# EAGLE design TAH Relay and Sensor Shield (EAGLE 7.0.0)
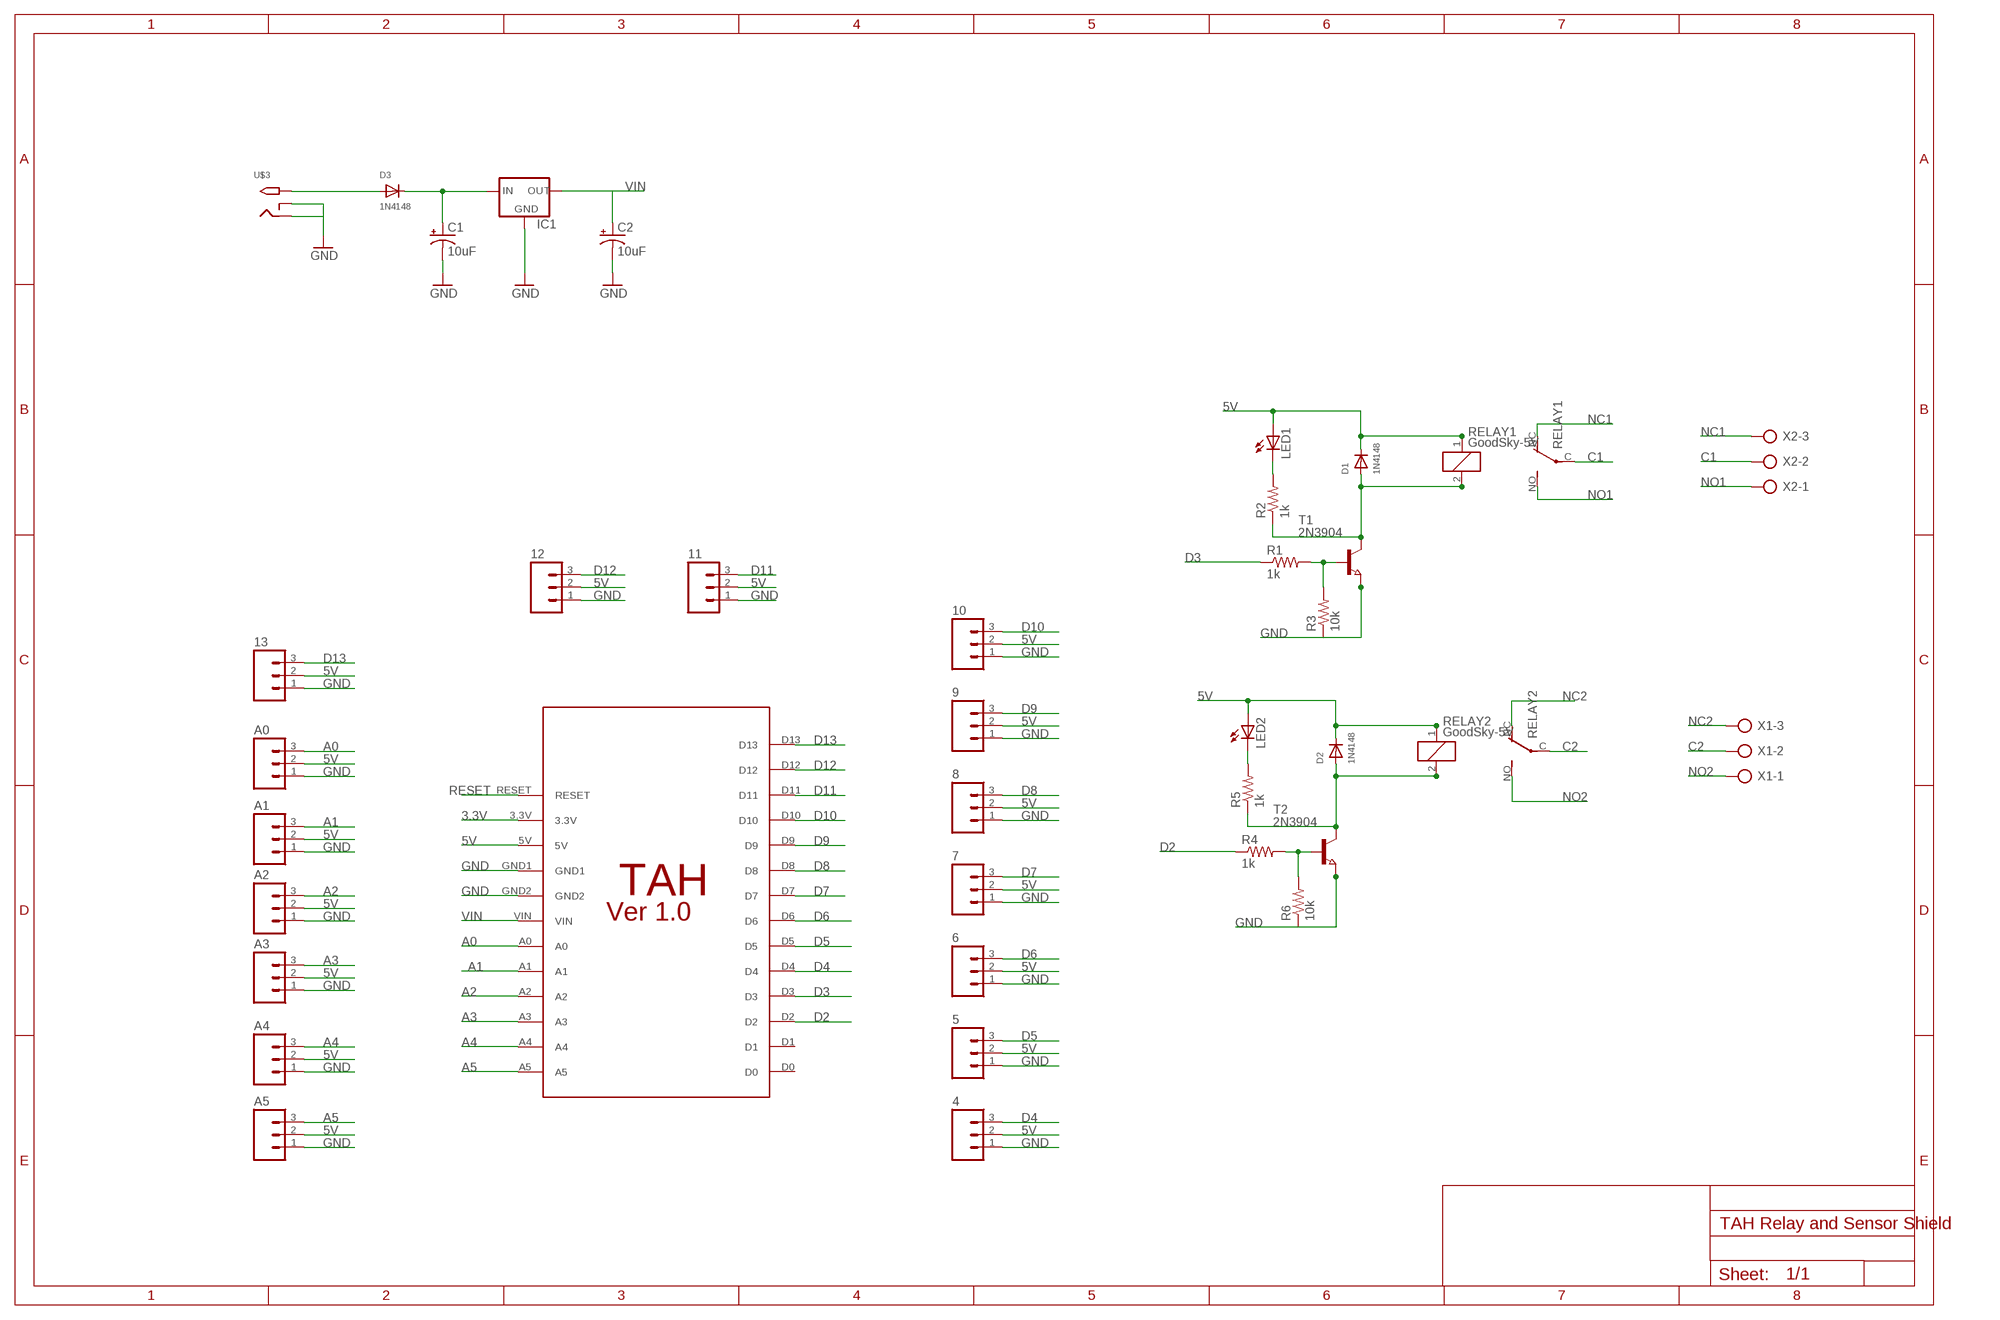
[diagram p0: schematic, sheet 1]

## Parts
4  M03POLAR  [MOLEX-1X3]
5  M03POLAR  [MOLEX-1X3]
6  M03POLAR  [MOLEX-1X3]
7  M03POLAR  [MOLEX-1X3]
8  M03POLAR  [MOLEX-1X3]
9  M03POLAR  [MOLEX-1X3]
10  M03POLAR  [MOLEX-1X3]
11  M03POLAR  [MOLEX-1X3]
12  M03POLAR  [MOLEX-1X3]
13  M03POLAR  [MOLEX-1X3]
A0  M03POLAR  [MOLEX-1X3]
A1  M03POLAR  [MOLEX-1X3]
A2  M03POLAR  [MOLEX-1X3]
A3  M03POLAR  [MOLEX-1X3]
A4  M03POLAR  [MOLEX-1X3]
A5  M03POLAR  [MOLEX-1X3]
C1  10uF  CPOL-USE2,5-6E  [E2,5-6E]
C2  10uF  CPOL-USE2,5-6E  [E2,5-6E]
D1  1N4148  DIODESMA  [SMADIODE]
D2  1N4148  DIODESMA  [SMADIODE]
D3  1N4148  DIODESMA  [SMADIODE]
IC1  V_REG_78XX-TO-220  [TO-220-ALT]
LED1  LEDSMT1206  [1206]
LED2  LEDSMT1206  [1206]
R1  1k  R-US_R1206  [R1206]
R2  1k  R-US_R1206  [R1206]
R3  10k  R-US_R1206  [R1206]
R4  1k  R-US_R1206  [R1206]
R5  1k  R-US_R1206  [R1206]
R6  10k  R-US_R1206  [R1206]
RELAY1  GoodSky-5V  CQ1-12V  [CQ1]
RELAY2  GoodSky-5V  CQ1-12V  [CQ1]
T1  2N3904  NPN-TRANSISTOR_SOT23  [SOT23]
T2  2N3904  NPN-TRANSISTOR_SOT23  [SOT23]
U$1  TAH_PIN_FOOTPRINT_WITHOUT_ICSP_VER1.0  [FOOTPRINT_WITHOUT_ICSP]
U$3  2.1MMJACKTHM  [PJ-102A]
X1  AK300/3  [AK300/3]
X2  AK300/3  [AK300/3]

## Nets
3.3V: U$1.3.3V
5V: 4.2 5.2 6.2 7.2 8.2 9.2 10.2 11.2 12.2 13.2 A0.2 A1.2 A2.2 A3.2 A4.2 A5.2 D1.C D2.C LED1.A LED2.A RELAY1.1 RELAY2.1 U$1.5V
A0: A0.3 U$1.A0
A1: A1.3 U$1.A1
A2: A2.3 U$1.A2
A3: A3.3 U$1.A3
A4: A4.3 U$1.A4
A5: A5.3 U$1.A5
C1: RELAY1.C(2:P) X2.2
C2: RELAY2.C(2:P) X1.2
D2: R4.1 U$1.D2
D3: R1.1 U$1.D3
D4: 4.3 U$1.D4
D5: 5.3 U$1.D5
D6: 6.3 U$1.D6
D7: 7.3 U$1.D7
D8: 8.3 U$1.D8
D9: 9.3 U$1.D9
D10: 10.3 U$1.D10
D11: 11.3 U$1.D11
D12: 12.3 U$1.D12
D13: 13.3 U$1.D13
GND: 4.1 5.1 6.1 7.1 8.1 9.1 10.1 11.1 12.1 13.1 A0.1 A1.1 A2.1 A3.1 A4.1 A5.1 C1.- C2.- IC1.GND R3.1 R6.1 T1.2(E) T2.2(E) U$1.GND1 U$1.GND2 U$3.RING U$3.RING_SW
N$1: D2.A R5.1 RELAY2.2 T2.3(C)
N$2: R4.2 R6.2 T2.1(B)
N$3: LED2.C R5.2
N$4: D3.A U$3.TIP
N$5: C1.+ D3.C IC1.IN
N$14: D1.A R2.1 RELAY1.2 T1.3(C)
N$15: R1.2 R3.2 T1.1(B)
N$16: LED1.C R2.2
NC1: RELAY1.NC(2:O) X2.3
NC2: RELAY2.NC(2:O) X1.3
NO1: RELAY1.NO(2:S) X2.1
NO2: RELAY2.NO(2:S) X1.1
RESET: U$1.RESET
VIN: C2.+ IC1.OUT U$1.VIN
Unconnected: U$1.D0 U$1.D1

## Library data of the parts
4-13 A0 A1-A5 = SparkFun-Connectors:M03: Header 3 Standard 3-pin 0.1" header. Use with straight break away headers (SKU : PRT-00116), right angle break away headers (PRT-00553), swiss pins (PRT-00743), machine pins (PRT-00117), and female headers (PRT-00115). Molex polarized connector foot print use with SKU : PRT-08232 with associated crimp pins and housings.
C1 C2 = Arduino Shield Pin Out:CPOL-US: POLARIZED CAPACITOR, American symbol
D1-D3 = 1n4148 diode sot 23:DIODE: Diode SMADIODE - SMA Surface Mount Package 20V 1A Schottky Diode Digikey: 641-1014-6-ND DO-1N4148 - Through Hole Small Current Diode SOD-123 20V 1 A (.5mV Vf) Schottky Diode - Digikey: MBRX120TPMSCT-ND SOD-323 10V 570mA (.38mV Vf, 3ns) Schottky Diode - Digikey: ZLLS410CT-ND SOD-523 30V 30mA Schottky Diode (RB751S-40TE61) - Digikey: RB751S-40TE61CT-ND SOT23-R/W - SOT23 Package (R = Solder Paste/Reflow Ovens, W = Hand-Soldering) BAT54Film 40V 300mA - Digikey: 497-7162-1-ND
IC1 = SparkFun-PowerIC:V_REG_78XX: Voltage Regulator Standard 7805 5V regulator. IGO (Input Ground Output). Spark Fun Electronics SKU : COM-00107
LED1 LED2 = adafruit:LED: LED OSRAM: - CHIPLED LG R971, LG N971, LY N971, LG Q971, LY Q971, LO R971, LY R971 LH N974, LH R974 LS Q976, LO Q976, LY Q976 LO Q996 - Hyper CHIPLED LW Q18S LB Q993, LB Q99A, LB R99A - SideLED LS A670, LO A670, LY A670, LG A670, LP A670 LB A673, LV A673, LT A673, LW A673 LH A674 LY A675 LS A676, LA A676, LO A676, LY A676, LW A676 LS A679, LY A679, LG A679 - Hyper Micro SIDELED® LS Y876, LA Y876, LO Y876, LY Y876 LT Y87S - SmartLED LW L88C, LW L88S LB L89C, LB L89S, LG L890 LS L89K, LO L89K, LY L89K LS L896, LA L896, LO L896, LY L896 - TOPLED LS T670, LO T670, LY T670, LG T670, LP T670 LSG T670, LSP T670, LSY T670, LOP T670, LYG T670 LG T671, LOG T671, LSG T671 LB T673, LV T673, LT T673, LW T673 LH T674 LS T676, LA T676, LO T676, LY T676, LB T676, LH T676, LSB T676, LW T676 LB T67C, LV T67C, LT T67C, LS T67K, LO T67K, LY T67K, LW E67C LS E67B, LA E67B, LO E67B, LY E67B, LB E67C, LV E67C, LT E67C LW T67C LS T679, LY T679, LG T679 LS T770, LO T770, LY T770, LG T770, LP T770 LB T773, LV T773, LT T773, LW T773 LH T774 LS E675, LA E675, LY E675, LS T675 LS T776, LA T776, LO T776, LY T776, LB T776 LHGB T686 LT T68C, LB T68C - Hyper Mini TOPLED® LB M676 - Mini TOPLED Santana® LG M470 LS M47K, LO M47K, LY M47K Source: http://www.osram.convergy.de/
R1-R6 = resistor:R-US_: RESISTOR, American symbol
RELAY1 RELAY2 = GoodSky Relay:CQ1-12V: AUTOMOTIVE QUIET RELAY NAiS Source: http://www.mew-europe.com/.. en_ds_61208_0000.pdf; OC_FARNELL: unknown; OC_NEWARK: unknown
T1 T2 = semicon-smd-ipc:NPN-TRANSISTOR_: NPN TRANSISTOR
U$1 = TAH:TAH_PIN_FOOTPRINT_WITHOUT_ICSP_VER1.0
U$3 = 1n4148 diode sot 23:2.1MMJACK: 2.1mm x 5.5mm THM DC jack with internal switch. Digikey part #PJ-102A, 4UCON part #05537 2.1mm x 5.5mm SMT DC jack with internal switch. Digikey part #PJ-002A-SMT, 4UCON part #03267 By microbuilder.eu & adafruit.com
X1 X2 = phoenix connector:AK300/3: CONNECTOR; OC_FARNELL: unknown; OC_NEWARK: unknown

## Net classes
0 default: clearance 0.355 mm

## Board
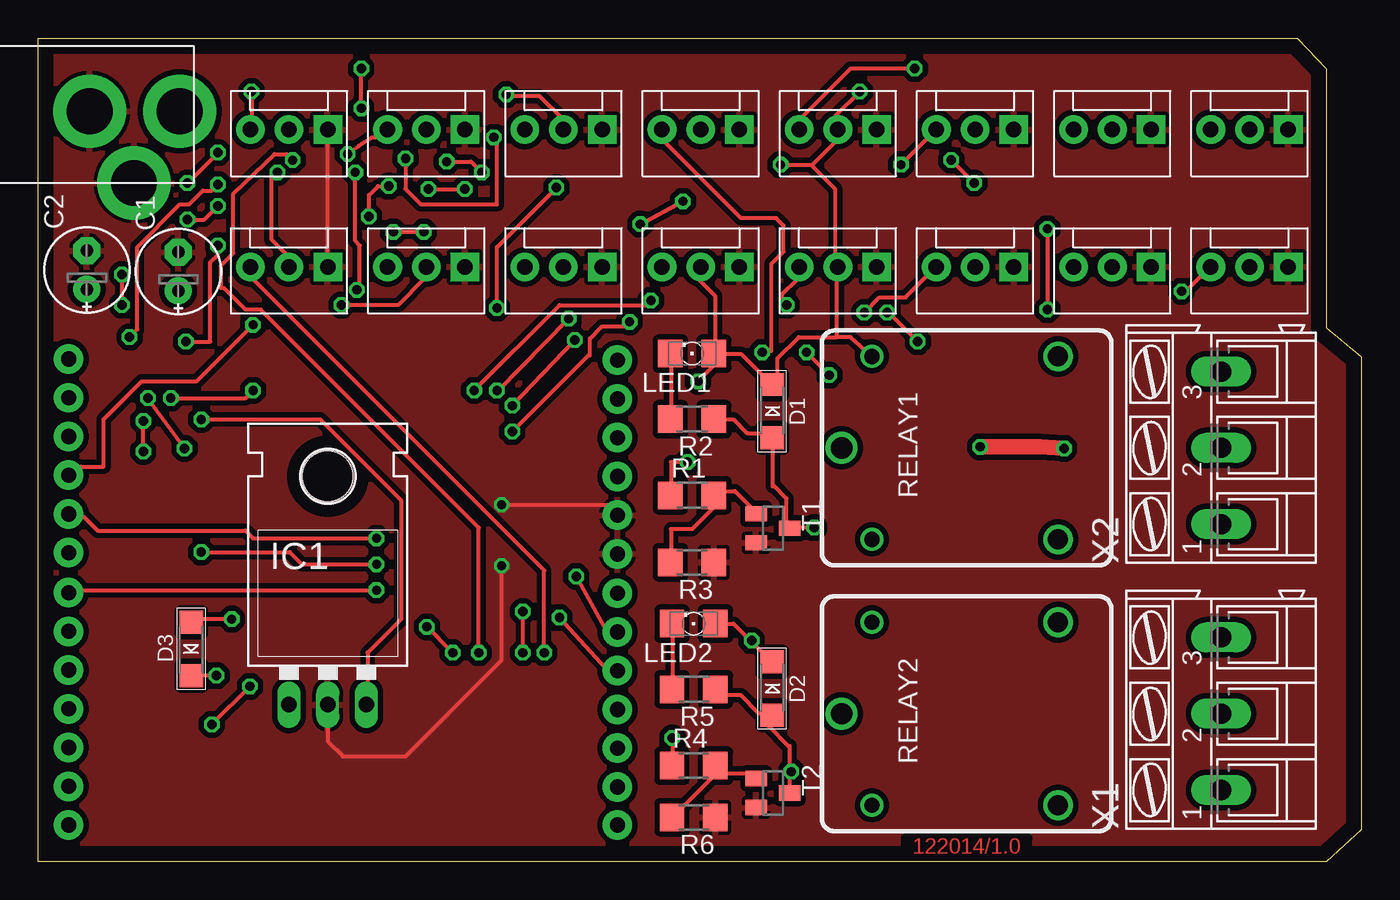
[diagram p1: board, top side]
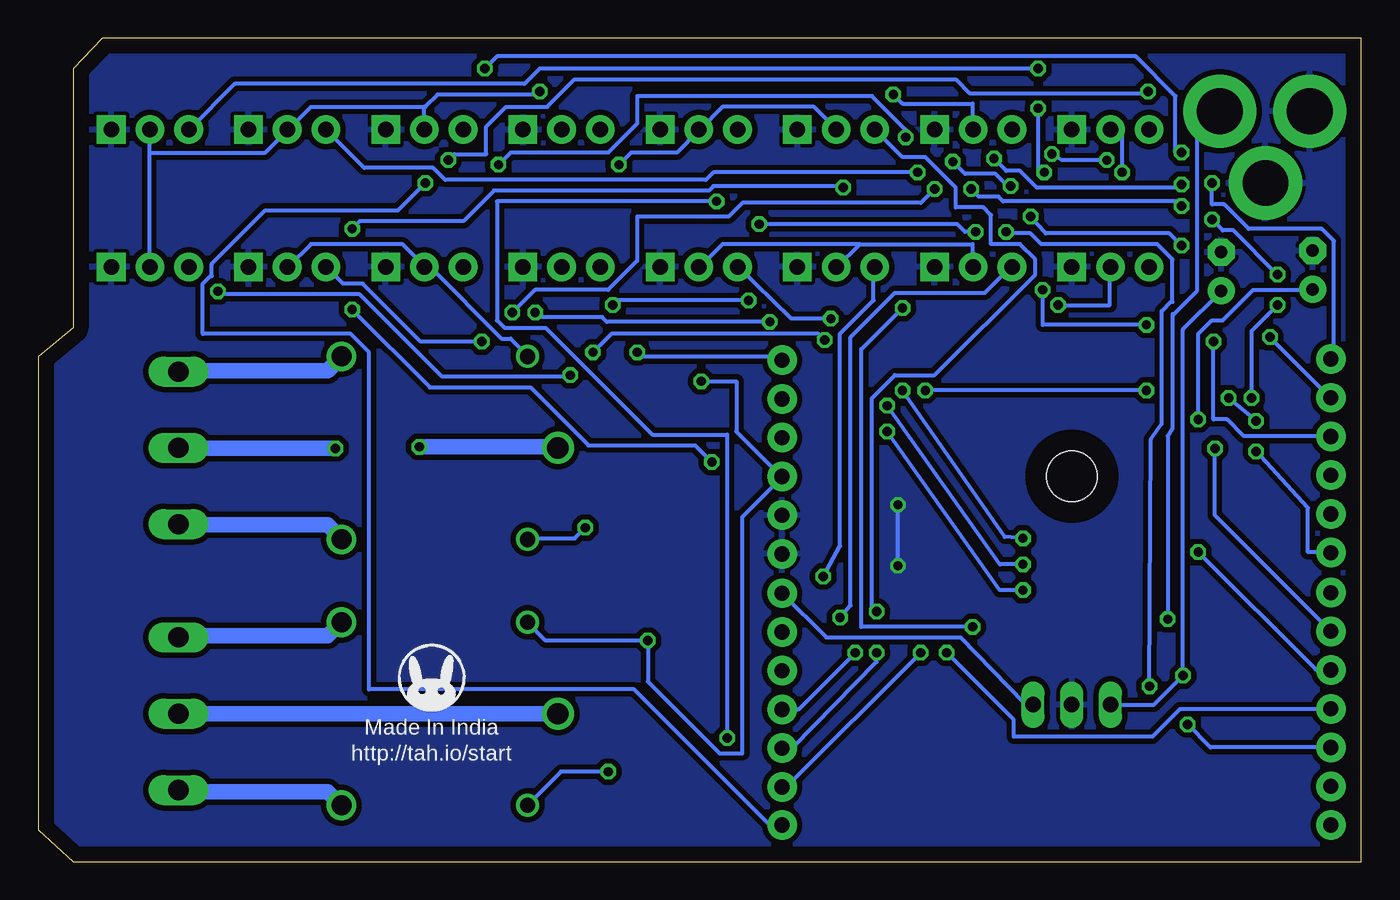
[diagram p2: board, bottom side, seen from below]

Size 86.8 x 54 mm. Coordinates in mm from the lower left corner, seen from the top.
Outline: 0,0 0,54 82.6,54 84.5,52 84.5,35 86.8,33.1 86.8,2.1 84.5,0 0,0
Copper layers (1*16): Top 0.035mm / dielectric 1.5mm / Bottom 0.035mm
Design rules "default": minimum track width 10mil, minimum drill 24mil, track to track 8mil, track to pad 8mil, pad to pad 8mil, via to via 8mil, smd to smd 8mil, copper to edge 40mil, drill to drill 8mil, minimum pad ring 10mil, minimum via ring 8mil, stop-mask expansion 4mil, vias tented up to drill 0mil, thermal gap 10mil

### Footprints (pad centres in the part's own frame; a part is rotated, then mirrored left to right if it is on the bottom)
MOLEX-1X3 = drill 1.016 pad 1.88 square: 1 0,0 | drill 1.016 pad 1.88: 2 2.54,0; 3 5.08,0
E2,5-6E = drill 0.813 pad 1.778: + -1.27,0 | drill 0.813 pad 1.778 octagon: - 1.27,0
SMADIODE = smd 1.524 x 1.5: A -0.05,-1.6; C -0.05,1.9
TO-220-ALT = drill 1.016 long: GND 0,-3.81; IN -2.54,-3.81; OUT 2.54,-3.81 | hole 3.302: 0,11.176
1206 = smd 1.6 x 1.803: A -1.422,0; C 1.422,0
R1206 = smd 1.6 x 1.803: 1 -1.422,0; 2 1.422,0
CQ1 = drill 1: 1 -6.3,6; 2 -6.3,-6 | drill 1.4: C -8.296,0 | drill 1.3: NC 5.9,6; NO 5.9,-6
SOT23 = smd 1 x 1.4: 1 -0.95,-1.1; 2 0.95,-1.1; 3 0,1.1
FOOTPRINT_WITHOUT_ICSP = drill 1 pad 1.93: 3.3V -17.55,11.97; 5V -17.55,9.43; A0 -17.55,-0.77; A1 -17.55,-3.31; A2 -17.55,-5.85; A3 -17.55,-8.39; A4 -17.55,-10.93; A5 -17.55,-13.43; D0 18.45,-13.43; D1 18.45,-10.89; D2 18.45,-8.35; D3 18.45,-5.81; D4 18.45,-3.27; D5 18.45,-0.73; D6 18.45,1.81; D7 18.45,4.43; D8 18.45,6.97; D9 18.45,9.51; D10 18.45,12.05; D11 18.45,14.59; D12 18.45,17.13; D13 -17.55,17.05; GND1 -17.55,6.89; GND2 -17.55,4.35; RESET -17.55,14.51; VIN -17.55,1.77
PJ-102A = drill 3 pad 4.8: RING 0.1,-3.39; RING_SW -4.6,-6.29; TIP 0.1,-9.29
AK300/3 = drill 1.321 long: 1 -5.004,0; 2 0,0; 3 5.004,0

### Placement (x,y rotation side)
4  82,39 180 top
5  73,39 180 top
6  64,39 180 top
7  55,39 180 top
8  46,39 180 top
9  82,48 180 top
10  73,48 180 top
11  64,48 180 top
12  55,48 180 top
13  46,48 180 top
A0  37,39 180 top
A1  28,39 180 top
A2  19,39 180 top
A3  37,48 180 top
A4  28,48 180 top
A5  19,48 180 top
C1  9.2,38.7 90 top
C2  3.2,38.8 90 top
D1  48.2,29.39 0 top
D2  48.2,11.2 0 top
D3  10,14.1 180 top
IC1  19,14.1 0 top
LED1  42.9,33.32 180 top
LED2  43,15.6 180 top
R1  42.9,24.02 0 top
R2  42.9,29.02 180 top
R3  42.9,19.62 180 top
R4  43,6.3 0 top
R5  43,11.3 180 top
R6  43,2.9 180 top
RELAY1  61,27.13 0 top
RELAY2  61,9.7 0 top
T1  48.2,21.86 270 top
T2  48.2,4.5 270 top
U$1  20.45,15.83 0 bottom
U$2  [TAHLOGO]  61,12.1 0 bottom
U$3  0,49.1 90 top
U$4  [TAH_SILK_FLIPPED]  20.6,17.7 0 top
X1  77.6,9.7 90 top
X2  77.6,27.13 90 top

### Tracks (layer width: path | path; a pad name or v marks a point on that pad's centre or on a via)
5V  (via drill 0.61)
  Top 0.254: v30.7,50.3 30.8,50.2 32.9,50.2 34.4,48.7 34.4,48 A3.2 | 50.8,45.7 52.3,47.2 52.4,47.2 52.4,48 12.2 52.4,48.1 52.3,48.1 52.3,48.9 v53.9,50.5 | v48.7,45.7 50.8,45.7 | 46.75,14.45 45.6,15.6 LED2.A | 46.75,14.45 48.1,13.1 D2.C | v46.8,14.5 46.75,14.45 | 52.4,34.4 52.4,39 7.2 52.4,39.1 52.3,39.1 52.3,44.1 50.8,45.6 50.8,45.7 | 52.4,34.4 53.3,34.4 54.6,33.2 54.7,33.2 RELAY1.1 | LED1.A 44.4,33.3 46.1,33.3 48.1,31.3 D1.C 48.2,31.4 48.5,31.4 48.5,33 49.9,34.4 52.4,34.4 | LED1.A 44.4,33.4 44.4,37.1 43.4,38.1 43.4,39 8.2 | v15.7,45.2 15.3,45.2 15.3,40.8 16.3,39.8 16.4,39.8 16.4,39 A2.2 | v19.9,36.5 23.6,36.5 25.4,38.3 25.4,39 A1.2 | v43.3,31.5 45,33.2 LED1.A
  Bottom 0.254: 61.5,49.5 61.5,48 11.2 | 61.5,49.5 68.9,49.5 70.4,48 10.2 70.5,47.9 71.9,46.5 79.5,46.5 | 79.5,46.5 79.5,48 9.2 | 79.5,46.5 79.5,39 4.2 | v30.7,50.3 30.1,49.7 25.5,49.7 25.5,48 A4.2 | A3.2 34.4,48 35.9,49.5 41.9,49.5 43.4,48 13.2 43.5,47.9 44.9,46.5 47.9,46.5 v48.7,45.7 | v53.9,50.5 54.1,50.3 60.6,50.3 61.4,49.5 61.5,49.5 | RELAY2.1 53.5,14.5 v46.8,14.5 46.8,11.8 42.1,7.1 40.6,7.1 40.6,22.6 38,25.2 U$1.5V 38.1,25.3 41,28.2 41,31.5 v43.3,31.5 | RELAY1.1 54.7,33.2 55.8,34.3 56.4,34.3 61.1,39 6.2 61.5,39.1 62.9,40.5 68.9,40.5 70.4,39 5.2 | v15.7,45.2 15.7,48 A5.2 | 32.9,40.5 25.5,40.5 25.5,39 A1.2 | 32.9,40.5 34.4,39 A0.2 | v19.9,36.5 16.5,36.5 16.5,39 A2.2 | 32.9,40.5 41.9,40.5 43.4,39 8.2
A0  (via drill 0.61)
  Top 0.254: v35.3,18.7 37.3,15.1 38,15.1 U$1.A0
  Bottom 0.254: v35.3,18.7 34.2,20.7 34.2,34.6 32,36.8 32,39 A0.3
A1  (via drill 0.61)
  Top 0.254: v34.2,16 37.3,12.6 38,12.6 U$1.A1
  Bottom 0.254: v34.2,16 33.5,16.8 33.5,34.4 30.6,37.3 24.7,37.3 23,39 A1.3
A2  (via drill 0.61)
  Top 0.254: v33.2,13.7 33.2,19.1 14.1,38.2 14,38.2 14,39 A2.3
  Bottom 0.254: v33.2,13.7 36.9,10 38,10 U$1.A2
A3  (via drill 0.61)
  Top 0.254: v31.8,13.7 v31.8,16.4
  Bottom 0.254: v31.8,16.4 32.1,16.4 32.1,30.4 30.6,31.9 28,31.9 21.4,38.5 21.4,39.5 22.4,40.5 24.3,40.5 24.3,42.4 24.8,42.9 26.6,42.9 26.6,44.2 28.6,46.2 30.1,46.2 31.9,48 A3.3 | v31.8,13.7 31.8,13.1 37.3,7.5 38,7.5 U$1.A3
A4  (via drill 0.6, 0.61)
  Top 0.254: v20.3,46.4 21,46.9 21.9,47.5 22.3,47.5 22.9,48 A4.3 | v16.7,46 16.3,46.4 15.5,46.4 12.8,43.8 12.8,39.9 12,39.1 12,37.6 12.2,37.6 13.6,36.2 14.6,36.2 28.9,21.9 v28.9,13.7
  Bottom 0.254: v16.7,46 19.6,46 v20.3,46.4 | v28.9,13.7 37.7,4.9 U$1.A4
A5  (via drill 0.61)
  Top 0.254: v14,50.5 14,48 A5.3 | v61.4,44.5 v59.9,46
  Bottom 0.254: v14,50.5 14.1,50.4 25.7,50.4 26.6,51.3 51.6,51.3 53.4,49.5 56.1,49.5 57.4,48.2 57.4,46.4 59.5,46.4 v59.9,46 | v61.4,44.5 63.2,42.7 71.9,42.7 75.4,39.2 75.4,38.4 75.5,38.4 76,37.9 76,34.6 66.3,34.6 65.1,33.4 65.1,11.3 47.7,11.3 38.8,2.4 U$1.A5
C1  (via drill 0.61)
  Top 1.016: v67.3,27.1 65.7,27.2 v61.8,27.2
  Bottom 0.254: 77.6,27.1 X2.2 | 52.8,27.2 RELAY1.C
  Bottom 1.016: v67.3,27.1 77.6,27.1 | 52.8,27.2 v61.8,27.2
C2
  Bottom 1.016: RELAY2.C X1.2
D2  (via drill 0.61)
  Top 0.254: v41.6,8.1 41.6,6.3 R4.1 | v39.5,41.8 v42.3,43.3 | v23.3,41.3 v25.3,41.3 | v11.4,9 v13.9,11.5
  Bottom 0.254: v41.6,8.1 41.6,28 46.5,28 53.5,35 56.2,35 56.7,35.5 56.7,43.3 v42.3,43.3 | v25.3,41.3 26,41.3 26.5,41.8 v39.5,41.8 | v23.3,41.3 23.1,41.2 21.7,41.2 21,40.5 13.4,40.5 12.4,39.5 12.4,36.7 12.5,36.7 13.1,36.1 13.1,28.7 13.8,27.7 v13.9,11.5 | v11.4,9 9.9,7.5 2,7.5 U$1.D2
D3  (via drill 0.61)
  Top 0.254: v42.6,26.2 41.5,26.2 41.5,24.1 R1.1 | v66.2,41.5 v66.2,36.2 | v34,44.2 30.1,40.3 v30.1,36.3 | v27.2,13.7 v25.5,15.4
  Bottom 0.254: v42.6,26.2 43.7,27.3 50.7,27.3 54.5,31.1 61.1,31.1 v66.2,36.2 | v66.2,41.5 65.7,42 58.9,42 56.9,44 42.8,44 42.5,44.3 34.1,44.3 v34,44.2 | v30.1,36.3 32.8,33.6 32.8,15.4 v25.5,15.4 | v27.2,13.7 22.8,9.3 22.8,8.2 13.7,8.2 11.9,10 2,10 U$1.D3
D4  (via drill 0.61)
  Top 0.254: v75,37.4 75.3,37.4 76.9,39 4.3 | v50.4,33.4 v51.9,31.9 | v31.1,29.9 v35.2,34.2 | v22.2,19.5 21.3,19.5 17.3,19.5 16.5,20.3 v10.7,20.3
  Bottom 0.254: v75,37.4 74.8,37.2 65.7,37.2 60.3,31.8 52,31.8 v51.9,31.9 | v50.4,33.4 49.2,34.6 35.6,34.6 v35.2,34.2 | v31.1,29.9 23.7,19.5 v22.2,19.5 | v10.7,20.3 3,12.6 2,12.6 U$1.D4
D5  (via drill 0.61)
  Top 0.254: v57.7,34.1 55.8,36 v55.7,36 | v25.6,44.1 v28,44.1 | v11.8,43 10.9,42.1 v9.8,42.1 | v5.5,36.5 v5.5,38.5 | v9.6,27.1 v7.2,30.4
  Bottom 0.254: v57.7,34.1 61.7,34.1 65.5,37.9 66.8,37.9 67.9,39 5.3 | v55.7,36 54.2,37.5 49.4,37.5 47.5,39.4 47.5,42.3 41.5,42.3 40.6,43.2 28.9,43.2 v28,44.1 | v25.6,44.1 25.1,43.6 23.8,43.6 23.5,43.3 12.1,43.3 v11.8,43 | v9.8,42.1 9.1,41.4 8.4,41.4 v5.5,38.5 | v5.5,36.5 7.2,34.8 v7.2,30.4 | v9.6,27.1 9.6,22.7 U$1.D5
D6  (via drill 0.61)
  Top 0.254: v54.2,36 55.2,37 56.9,37 58.9,39 6.3 | v38.8,35.4 38.5,35.1 37,35.1 36.2,34.3 36.2,33.2 36.1,33.2 v31.1,28.2 | v22.2,17.8 2.1,17.8 2,17.7 U$1.D6
  Bottom 0.254: v54.2,36 53.9,35.7 49.8,35.7 49.5,35.4 v38.8,35.4 | v31.1,28.2 23.7,17.8 v22.2,17.8
D7  (via drill 0.61)
  Top 0.254: v49.1,36.5 48.8,36.5 48.8,37.2 49.8,38.2 49.9,38.2 49.9,39 7.3 | v40.2,36.8 39.9,36.5 34.2,36.5 v28.6,30.9 | v14.1,30.9 13.6,30.4 v8.7,30.4 | v6.9,26.9 v6.9,28.9
  Bottom 0.254: v49.1,36.5 48.8,36.8 v40.2,36.8 | v14.1,30.9 v28.6,30.9 | v6.9,28.9 v8.7,30.4 | v6.9,26.9 3.5,23.2 3.5,20.3 2,20.3 U$1.D7
D8  (via drill 0.61)
  Top 0.254: v34.8,35.6 30.2,30.9 v30.1,30.9 | v22.2,21.2 14.1,21.2 13.6,21.7 3.9,21.7 3,22.6 2.2,22.6 U$1.D8
  Bottom 0.254: v34.8,35.6 37.4,35.6 40.9,39 8.3 | v30.1,30.9 23.4,21.3 v22.2,21.2
D9  (via drill 0.61)
  Top 0.254: v21.2,49.4 v21.2,52 | v20.8,45.2 20.8,40.7 21.1,40.4 21.1,37.5 v20.9,37.5 | v14.1,35.2 10.4,31.5 6.8,31.5 4.3,29 4.3,25.9 2.8,25.9 2.3,25.4 2,25.4 U$1.D9
  Bottom 0.254: v21.2,52 53.9,52 54.9,51 73.9,51 76.9,48 9.3 | v21.2,49.4 21.2,45.2 v20.8,45.2 | v20.9,37.5 20.9,35.2 v14.1,35.2
D10  (via drill 0.61)
  Top 0.254: v29.1,45.2 28.4,45.9 v26.8,45.9 | v23,44.3 22.3,44.3 21.7,43.7 v21.7,42.3 | v11.8,40.4 11.8,39.8 11.3,39.3 11.3,34.1 v9.7,34.1
  Bottom 0.254: v29.1,45.2 42.5,45.2 43,44.7 60.1,44.7 60.9,45.5 65.4,45.5 67.9,48 10.3 | v26.8,45.9 26,45.1 24,45.1 23.2,44.3 v23,44.3 | v21.7,42.3 20.7,41.2 12.6,41.2 v11.8,40.4 | v9.7,34.1 9.7,29 8.8,29 7.7,27.9 2,27.9 U$1.D10
D11  (via drill 0.61)
  Top 0.254: v56.6,45.7 58.9,48 11.3 | v29.9,47.5 30.1,47.3 30.1,43.1 25.1,43.1 24.1,44.1 v24.1,46.1 | v11.8,44.4 11.4,44 10.8,44 9.9,43.1 9.3,43.1 6.5,40.3 6.5,34.9 v6,34.4
  Bottom 0.254: v56.6,45.7 55.8,46.5 49.4,46.5 47.5,48.4 47.5,50.2 32.1,50.2 29.9,48 v29.9,47.5 | v24.1,46.1 23.3,45.3 22.4,45.3 21.3,44.2 12,44.2 v11.8,44.4 | v6,34.4 2.1,30.5 2,30.5 U$1.D11
D12  (via drill 0.61)
  Top 0.254: v57.5,52 53.3,52 50.1,48.8 50,48.8 50,48 12.3 | v9.8,44.5 v11.8,46.5
  Bottom 0.254: v57.5,52 56.7,52.8 14.8,52.8 12.2,50.2 12.2,46.5 v11.8,46.5 | v9.8,44.5 9.8,43.1 9,43.1 7.4,41.5 2.6,41.5 1.8,40.7 1.8,33 2,33 U$1.D12
D13  (via drill 0.61)
  Top 0.254: v47.5,33.4 47.6,33.5 48.1,33.5 48.1,39.2 48.9,40 48.9,41.7 48.4,42.2 46.1,42.2 41.1,47.2 41,47.2 41,48 13.3
  Bottom 0.254: v47.5,33.4 47.2,33.1 38.2,33.1 38,32.9 U$1.D13
GND  (via drill 0.6)
  Top 0.254: IC1.GND 19,7.9 20,6.9 24.1,6.9 30.4,13.2 v30.4,19.4 | v30.4,23.4 37.32,23.4 U$1.GND1 | A2.1 A5.1
  Bottom 0.254: v30.4,19.4 v30.4,23.4
  pour Bottom: 0,0 0,54 82.6,54 84.5,52.1 84.5,35.3 86.8,33 86.8,2.1 86.7,2 84.5,0
  pour Top: 0,0 0,54 82.6,54 84.5,52.1 84.5,35 86.8,33.1 86.8,2.2 84.6,0
N$1  (via drill 0.61)
  Top 0.254: 49.3,5.9 49.3,7.6 49.2,7.6 47.9,8.9 47.9,9.6 D2.A 47.9,9.7 47.3,9.7 46.1,10.9 44.9,10.9 44.5,11.3 R5.1 | 49.3,5.9 T2.3 | v49.4,5.9 49.3,5.9
  Bottom 0.254: RELAY2.2 52.5,5.9 v49.4,5.9
N$2
  Top 0.254: T2.1 47.1,5.5 46.8,5.8 45,5.8 44.5,6.3 R4.2 44.7,6 41.6,2.9 R6.2
N$3
  Top 0.254: R5.2 41.6,11.3 41.6,15.6 LED2.C
N$4  (via drill 0.61)
  Top 0.254: v12.7,15.9 10.3,15.9 10.1,15.7 D3.A
  Bottom 0.254: v12.7,15.9 12.7,27.9 12.4,28.4 12.4,35.9 12.3,35.9 10.8,37.4 10.8,49.2 U$3.TIP
N$5  (via drill 0.61)
  Top 0.254: v11.7,12.2 D3.C
  Bottom 0.254: IC1.IN 16.4,10.3 13.6,10.3 v11.7,12.2 11.7,34.9 9.2,37.4 C1.+
N$14  (via drill 0.61)
  Top 0.254: R2.1 44.4,29 45.6,29 46.5,28.1 47.8,28.1 48.1,27.8 D1.A 48.2,27.7 48.2,24.6 48.3,24.6 49.1,23.8 49.1,22 49.3,22 T1.3 49.3,21.9 v50.9,21.9
  Bottom 0.254: v50.9,21.9 51.6,21.2 54.7,21.2 RELAY1.2
N$15
  Top 0.254: T1.1 47.1,22.9 45.7,24.3 44.6,24.3 44.4,24.1 R1.2 44.3,23.9 44.3,23.2 42.9,21.8 41.5,21.8 41.5,19.7 R3.2
N$16
  Top 0.254: R2.2 41.5,29.1 41.5,33.3 LED1.C
NC1
  Bottom 0.254: 66.9,33.1 RELAY1.NC | 77.6,32.2 X2.3
  Bottom 1.016: 66.9,33.1 67.8,32.2 77.6,32.2
NC2
  Bottom 0.254: 77.6,14.8 X1.3
  Bottom 1.016: RELAY2.NC 67.8,14.8 77.6,14.8
NO1
  Bottom 0.254: 66.9,21.2 RELAY1.NO | 77.6,22.1 X2.1
  Bottom 1.016: 66.9,21.2 67.8,22.1 77.6,22.1
NO2
  Bottom 0.254: 77.6,4.6 X1.1
  Bottom 1.016: RELAY2.NO 67.8,4.6 77.6,4.6
VIN  (via drill 0.61)
  Top 0.254: v10.7,29 18.5,29 23.8,23.7 23.8,15.9 21.6,13.7 21.6,10.35 IC1.OUT
  Bottom 0.254: U$1.VIN 35.1,14.7 26.3,14.7 22.1,10.4 21.8,10.3 21.75,10.35 21.6,10.3 IC1.OUT | v10.7,29 10.7,34.6 9.8,35.5 9.1,35.5 7.1,37.5 3.2,37.5 C2.+

### Text on the board
Top: 122014/1.0
bPlace: Made In India | http://tah.io/start
_tNames: A5 | 5V | GND | A4 | 5V | GND | A3 | 5V | GND | D13 | 5V | GND | GND | D12 | 5V | GND | D11 | 5V | GND | D10 | 5V | GND | D9 | 5V | GND | A2 | 5V | GND | A1 | 5V | GND | A0 | 5V | GND | D8 | 5V | GND | D7 | 5V | GND | D6 | 5V | GND | D5 | 5V | GND | D4 | 5V | GND | C2 | C1 | LED1 | NC | D1 | RELAY1 | R2 | C | R1 | NO | T1 | R3 | NC | 7805 | LED2 | D3 | D2 | R5 | RELAY2 | C | R4 | NO | Relay and Sensor Shield | Version 1.0 | T2 | R6